# Altium schematic sheet Regulator.SchDoc
size A; SheetNumber: 2; SheetTotal: 2
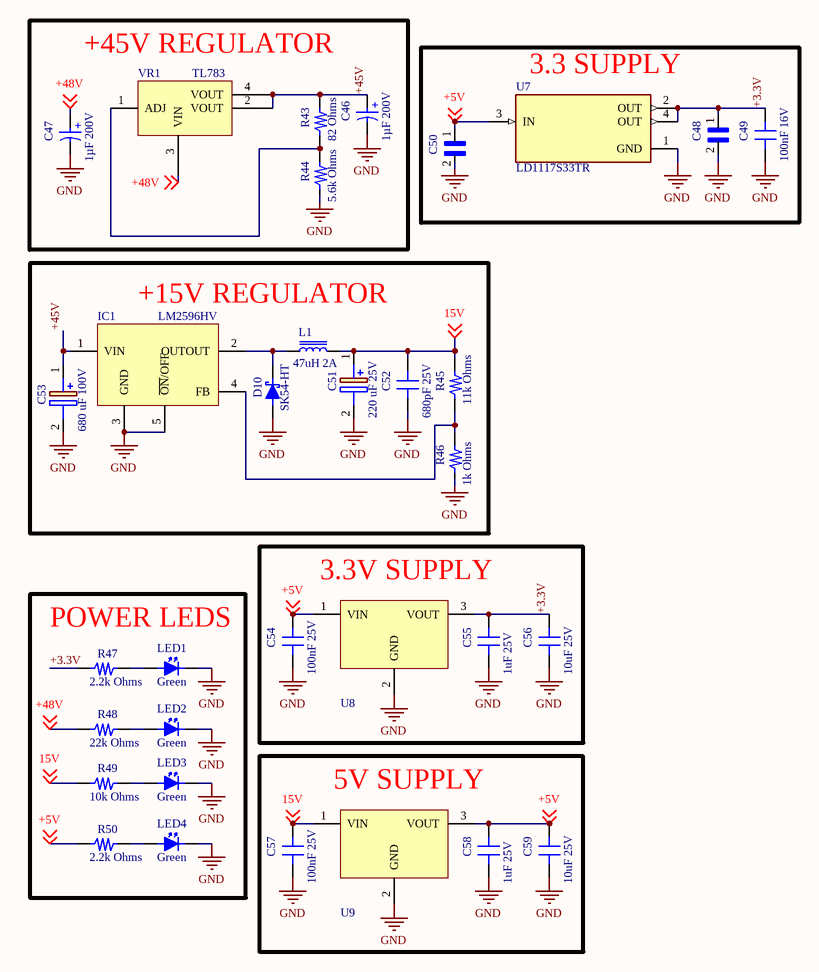
[diagram p0: Regulator.SchDoc]

## Parts
C46  1µF 200V  [WCAP-ATG5_D5H11]
C47  1µF 200V  [WCAP-ATG5_D5H11]
C48  (no value)  [CAPC3216X110N]
C49  100nF 16V  [0805_CAP]
C50  (no value)  [CAPC3216X110N]
C51  220 uF 25V  [CAPAE1030X1060N]
C52  680pF 25V  [0805_CAP]
C53  680 uF 100V  [CAPAE1030X1060N]
C54  100nF 25V  [0805_CAP]
C55  1uF 25V  [0805_CAP]
C56  10uF 25V  [0805_CAP]
C57  100nF 25V  [0805_CAP]
C58  1uF 25V  [0805_CAP]
C59  10uF 25V  [0805_CAP]
D10  SK54-HT  [DO-214AB]
IC1  LM2596HV  [TO-263-5]
L1  47uH 2A  [BOURNS SRR1280]
LED1  Green  [0805LED]
LED2  Green  [0805LED]
LED3  Green  [0805LED]
LED4  Green  [0805LED]
R43  82 Ohms  [0805_RES]
R44  5.6k Ohms  [0805_RES]
R45  11k Ohms  [0805_RES]
R46  1k Ohms  [0805_RES]
R47  2.2k Ohms  [0805_RES]
R48  22k Ohms  [0805_RES]
R49  10k Ohms  [0805_RES]
R50  2.2k Ohms  [0805_RES]
U7  LD1117S33TR  [SOT230P700X180-4N]
U8  7-28Vin, 3.3Vout, 1Aout  [WPME-FDSM_SIP-3_L11.6W8.5H10.5]  (value not drawn)
U9  7-28Vin, 3.3Vout, 1Aout  [WPME-FDSM_SIP-3_L11.6W8.5H10.5]  (value not drawn)
VR1  TL783  [TL783]

## Nets
GND: C46.2(N) C47.2(N) C48.2 C49.1 C50.2 C51.2(-) C52.1 C53.2(-) C54.1 C55.1 C56.1 C57.1 C58.1 C59.1 D10.1 IC1.3(GND) IC1.5(~{ON}/OFF) LED1.2(Cathode(-)) LED2.2(Cathode(-)) LED3.2(Cathode(-)) LED4.2(Cathode(-)) R44.2 R46.2 U7.1(GND) U8.2(GND) U9.2(GND)
+3.3V: C48.1 C49.2 C55.2 C56.2 R47.2 U7.2(OUT) U7.4(OUT) U8.3(VOUT)
+5V: C50.1 C54.2 C58.2 C59.2 R50.2 U7.3(IN) U8.1(VIN) U9.3(VOUT) ; off-sheet +5V
+45V: C46.1(P) C53.1(+) IC1.1(VIN) R43.1 VR1.2(VOUT) VR1.4(VOUT)
+48V: C47.1(P) R48.2 VR1.3(VIN) ; off-sheet +48V
\: C51.1(+) C52.2 C57.2 L1.2 R45.1 R49.2 U9.1(VIN) ; off-sheet 15V  [also labelled 15V]
NetD10_2: D10.2 IC1.2(OUTOUT) L1.1
NetIC1_4: IC1.4(FB) R45.2 R46.1
NetLED1_1: LED1.1(Anode(+)) R47.1
NetLED2_1: LED2.1(Anode(+)) R48.1
NetLED3_1: LED3.1(Anode(+)) R49.1
NetLED4_1: LED4.1(Anode(+)) R50.1
NetR43_2: R43.2 R44.1 VR1.1(ADJ)

## Notes on the sheet
- (near VR1) +45V REGULATOR
- (near U7) 3.3 SUPPLY
- +15V REGULATOR
- (near U8) 3.3V SUPPLY
- POWER LEDS
- (near U9) 5V SUPPLY
- (in symbol 860020772010) +

## Library data of the parts
C46 C47 = 860020772010: WCAP-ATG5 Aluminum Electrolytic Capacitor, Radial, THT, D5 x H11mm, 10µF, 63V; Manufacturer: Wurth Elektronik; Capacitance Tolerance: +/-20%; Dissipation Factor: 9%; Endurance: 2000h; Leakage Current: 6.3µA; Ripple Current: 42mA; Technical Reference: ATDC110100M063DSPA3B000; Manufacturer Part Number: 860020772010; Category: Aluminum Electrolytic Capacitors; Match Code: WCAP-ATG5; ComponentLink1Description: Website Link; ComponentLink1URL: https://www.we-online.com/redexpert/article/860020772010?ad; ComponentLink2Description: Datasheet Link; ComponentLink2URL: https://www.we-online.com/redexpert/spec/860020772010?ad; Mount: Through Hole; Operating Temperature Max: 105°C; Operating Temperature Min: -40°C; Packaging: Ammo Pack; Height: 11mm; Diameter: 5mm; Rated Voltage (DC): 63V; Capacitance: 1µF 200V
C48 C50 = C1206C105K5RACTU: 1206 Tantalum 10 uF 16V; Value: 10uF; MF: KEMET; MP: C1206C105K5RACTU; Package: 3216 KEMET; SnapEDA_Link: https://www.snapeda.com/parts/C1206C105K5RACTU/KEMET/view-part/357507/?ref=snap; Digi-Key_Part_Number: 399-8147-1-ND; Digi-Key_Purchase_URL: https://www.digikey.com/product-detail/en/kemet/C1206C105K5RACTU/399-8147-1-ND/3471870?utm_source=snapeda&utm_medium=aggregator&utm_campaign=symbol
C49 C52 C54-C59 = CAP_0805
  C49: Value: 100nF 16V
  C52: Value: 680pF 25V
  C54 C57: Value: 100nF 25V
  C55 C58: Value: 1uF 25V
  C56 C59: Value: 10uF 25V
C51 C53 = CK1H221M-CRG10: Capacitor Polarised; Manufacturer_Name: SEMTECH; Datasheet Link: https://datasheet.lcsc.com/szlcsc/1810281207_ST-Semtech-CK1H221M-CRG10_C131159.pdf; Height: 10.6mm; Manufacturer_Part_Number: CK1H221M-CRG10
D10 = SS36-214AB-HT: Schottky Diode; PartNumber: SK54-HT; ComponentLink1Description: Özdisan; ComponentLink1URL: https://ozdisan.com/guc-yari-iletkenleri/diyotlar-modul-diyotlar-ve-dogrultucular/schottky-diyotlar/SS36-214AB-HT/475999; ComponentLink2Description: Datasheet; ComponentLink2URL: https://cdn.ozdisan.com/ETicaret_Dosya/475999_7494647.pdf
IC1 = LM2596HV: Integrated Circuit; Manufacturer_Name: Texas Instruments; Datasheet Link: http://www.ti.com/lit/ds/symlink/lm2596.pdf; PartValue: LM2596HV; Mouser Part Number: 926-LM2596S-12; Mouser Price/Stock: https://www.mouser.co.uk/ProductDetail/Texas-Instruments/LM2596S-12?qs=X1J7HmVL2ZEK1FPBBSYJCA%3D%3D; Arrow Part Number: LM2596S-12; Arrow Price/Stock: https://www.arrow.com/en/products/lm2596s-12/texas-instruments
L1 = Inductor: FIXED IND 47UH 2.9A 80 MOHM SMD; Value: 47uH 2A
LED1-LED4 = LED: 0805
R43-R50 = RES_0805: 0805; Power: 1/8 W
  R43: Value: 82 Ohms
  R44: Value: 5.6k Ohms
  R45: Value: 11k Ohms
  R46: Value: 1k Ohms
  R47 R50: Value: 2.2k Ohms
  R48: Value: 22k Ohms
  R49: Value: 10k Ohms
U7 = LD1117S33TR: Linear Voltage Regulator IC Positive Fixed 1 Output 800mA SOT-223; MF: STMicroelectronics; Value: *; SnapEDA_Link: https://www.snapeda.com/parts/LD1117S33TR/STMicroelectronics/view-part/?ref=snap; MP: LD1117S33TR; Purchase-URL: https://pricing.snapeda.com/search/part/LD1117S33TR/?ref=eda; Check_prices: https://www.snapeda.com/parts/LD1117S33TR/STMicroelectronics/view-part/?ref=eda; Availability: In Stock; Price: None; Package: TO-261-4 STMicroelectronics
U8 U9 = 173010378: WPME-FDSM Fixed Step Down Regulator Module, THT, SIP-3, 7-28Vin, 3.3Vout, 1Aout; Manufacturer: Wurth Elektronik; Input Voltage Min: 7V; Input Voltage Max: 28V; Output Current: 1A; Output Voltage: 3.3V; Manufacturer Part Number: 173010378; Category: Step Down Converter; Match Code: WPME-FDSM; ComponentLink1Description: Website Link; ComponentLink1URL: https://www.we-online.com/redexpert/article/173010378?ad; ComponentLink2Description: Datasheet Link; ComponentLink2URL: https://www.we-online.com/redexpert/spec/173010378?ad; Mount: Through Hole; Operating Temperature Max: 85°C; Operating Temperature Min: -40°C; Packaging: Tube; Case/Size Code: SIP-3; Length: 11.6mm; Width: 8.5mm; Height: 10.5mm
VR1 = TL783/SMD